# EAGLE design red_glow (EAGLE 7.4.0)
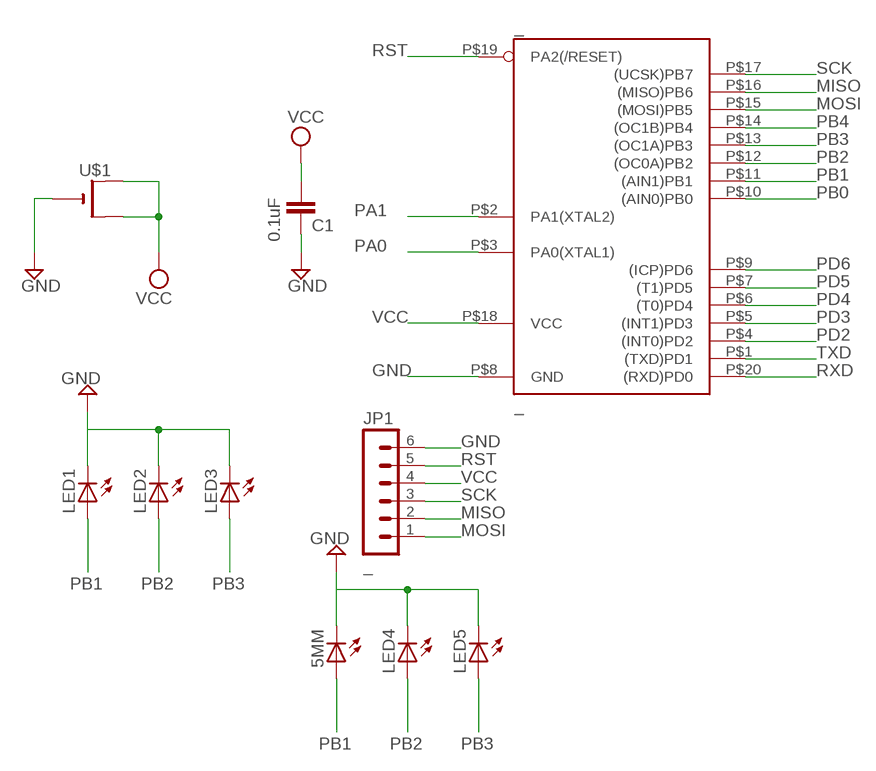
[diagram p0: schematic, sheet 1]

## Parts
5MM  LED5MM  [LED5MM]
_  _  TINY2313-*M*  [MLF20]
C1  0.1uF  CAP0805  [0805]
JP1  _  MA06-1  [MA06-1]
LED1  LED1206  [LED-1206]
LED2  LED1206  [LED-1206]
LED3  LED1206  [LED-1206]
LED4  LED5MM  [LED5MM]
LED5  LED5MM  [LED5MM]
U$1  CR2032SMT  [CR2032-SMD]

## Nets
GND [power]: 5MM.K(C) _.P$8(GND) C1.2 JP1.6 LED1.C LED2.C LED3.C LED4.K(C) LED5.K(C) U$1.-
MISO: _.P$16((MISO)PB6) JP1.2
MOSI: _.P$15((MOSI)PB5) JP1.1
PA0: _.P$3(PA0(XTAL1))
PA1: _.P$2(PA1(XTAL2))
PB0: _.P$10((AIN0)PB0)
PB1: 5MM.A _.P$11((AIN1)PB1) LED1.A
PB2: _.P$12((OC0A)PB2) LED2.A LED4.A
PB3: _.P$13((OC1A)PB3) LED3.A LED5.A
PB4: _.P$14((OC1B)PB4)
PD2: _.P$4((INT0)PD2)
PD3: _.P$5((INT1)PD3)
PD4: _.P$6((T0)PD4)
PD5: _.P$7((T1)PD5)
PD6: _.P$9((ICP)PD6)
RST: _.P$19(PA2(/RESET)) JP1.5
RXD: _.P$20((RXD)PD0)
SCK: _.P$17((UCSK)PB7) JP1.3
TXD: _.P$1((TXD)PD1)
VCC [power]: _.P$18(VCC) C1.1 JP1.4 U$1.+$1(+) U$1.+$2(+1)

## Library data of the parts
5MM LED4 LED5 = adafruit:LED: LED OSRAM: - CHIPLED LG R971, LG N971, LY N971, LG Q971, LY Q971, LO R971, LY R971 LH N974, LH R974 LS Q976, LO Q976, LY Q976 LO Q996 - Hyper CHIPLED LW Q18S LB Q993, LB Q99A, LB R99A - SideLED LS A670, LO A670, LY A670, LG A670, LP A670 LB A673, LV A673, LT A673, LW A673 LH A674 LY A675 LS A676, LA A676, LO A676, LY A676, LW A676 LS A679, LY A679, LG A679 - Hyper Micro SIDELED® LS Y876, LA Y876, LO Y876, LY Y876 LT Y87S - SmartLED LW L88C, LW L88S LB L89C, LB L89S, LG L890 LS L89K, LO L89K, LY L89K LS L896, LA L896, LO L896, LY L896 - TOPLED LS T670, LO T670, LY T670, LG T670, LP T670 LSG T670, LSP T670, LSY T670, LOP T670, LYG T670 LG T671, LOG T671, LSG T671 LB T673, LV T673, LT T673, LW T673 LH T674 LS T676, LA T676, LO T676, LY T676, LB T676, LH T676, LSB T676, LW T676 LB T67C, LV T67C, LT T67C, LS T67K, LO T67K, LY T67K, LW E67C LS E67B, LA E67B, LO E67B, LY E67B, LB E67C, LV E67C, LT E67C LW T67C LS T679, LY T679, LG T679 LS T770, LO T770, LY T770, LG T770, LP T770 LB T773, LV T773, LT T773, LW T773 LH T774 LS E675, LA E675, LY E675, LS T675 LS T776, LA T776, LO T776, LY T776, LB T776 LHGB T686 LT T68C, LB T68C - Hyper Mini TOPLED® LB M676 - Mini TOPLED Santana® LG M470 LS M47K, LO M47K, LY M47K Source: http://www.osram.convergy.de/
_ = NSL_Cylon:TINY2313*: Atmel Tiny2313 2K Flash, 128 bytes EEPROM, 128 bytes RAM
C1 = SparkFun:CAP: Capacitor Standard 0603 ceramic capacitor, and 0.1" leaded capacitor.
JP1 = con-lstb:MA06-1: PIN HEADER
LED1-LED3 = SparkFun-LED:LED: LEDs Standard schematic elements and footprints for 5mm, 3mm, 1206, and 0603 sized LEDs. 5mm - Spark Fun Electronics SKU : COM-00529 (and others)
U$1 = adafruit:CR2032

## Net classes
1 power: width 0.254 mm
2 leds: width 0.508 mm

## Board
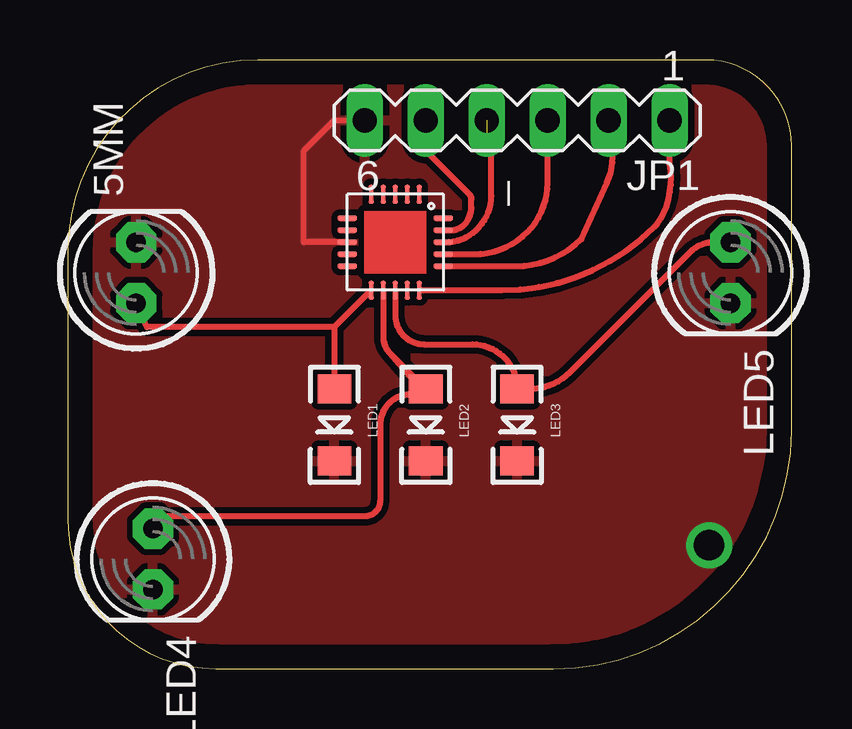
[diagram p1: board, top side]
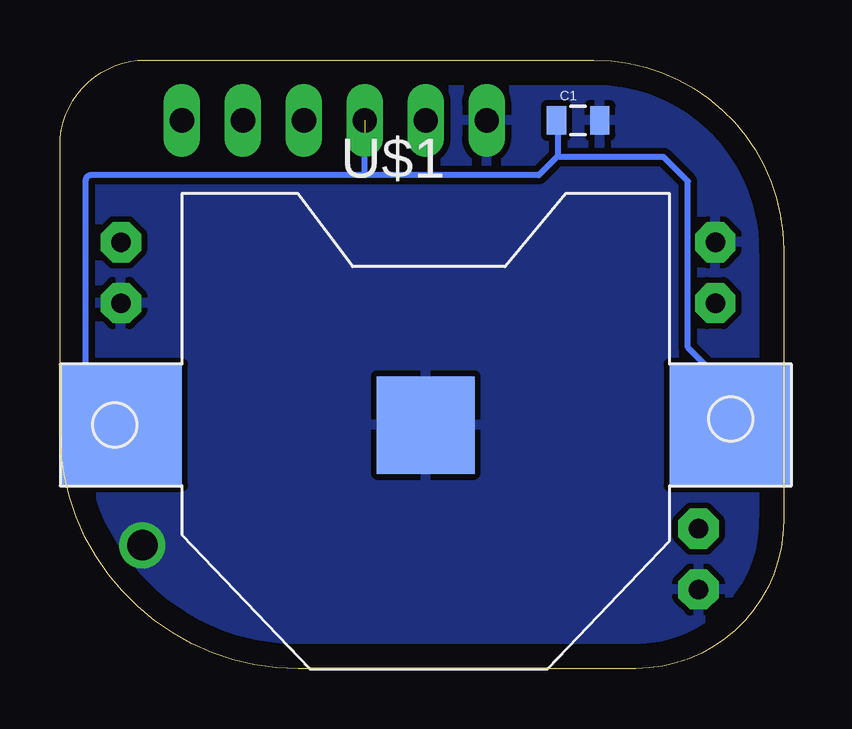
[diagram p2: board, bottom side, seen from below]

Size 30.15 x 25.38 mm. Coordinates in mm from the lower left corner, seen from the top.
Outline: 26.57,25.38 7.91,25.38 arc90 0,17.47 0,6.16 arc90 6.16,0 20.23,0 arc90 30.15,9.92 30.15,21.8 arc90 26.57,25.38
Copper layers (1*16): Top 0.035mm / dielectric 1.5mm / Bottom 0.035mm
Design rules "default": minimum track width 10mil, minimum drill 24mil, track to track 8mil, track to pad 8mil, pad to pad 8mil, via to via 8mil, smd to smd 8mil, copper to edge 40mil, drill to drill 8mil, minimum pad ring 10mil, minimum via ring 8mil, stop-mask expansion 4mil, vias tented up to drill 0mil, thermal gap 10mil

### Footprints (pad centres in the part's own frame; a part is rotated, then mirrored left to right if it is on the bottom)
LED5MM = drill 0.813 pad 1.676 octagon: A -1.27,0; K 1.27,0
MLF20 = smd 0.8 x 0.23: P$1 -2,1; P$2 -2,0.5; P$3 -2,0; P$4 -2,-0.5; P$5 -2,-1; P$11 2,-1; P$12 2,-0.5; P$13 2,0; P$14 2,0.5; P$15 2,1 | smd 0.23 x 0.8: P$6 -1,-2; P$7 -0.5,-2; P$8 0,-2; P$9 0.5,-2; P$10 1,-2; P$16 1,2; P$17 0.5,2; P$18 0,2; P$19 -0.5,2; P$20 -1,2
0805 = smd 0.8 x 1.2: 1 -0.9,0; 2 0.9,0
MA06-1 = drill 1.016 long: 1 -6.35,0; 2 -3.81,0; 3 -1.27,0; 4 1.27,0; 5 3.81,0; 6 6.35,0
LED-1206 = smd 1.2 x 1.4: A -1.5,0; C 1.5,0
CR2032-SMD = smd 5.08 x 5.08: +$1 -12.7,0; +$2 12.7,0 | smd 4.064 x 4.064: - 0,0

### Placement (x,y rotation side)
5MM  2.85,16.51 90 top
_  13.64,17.78 270 top
C1  8.56,22.86 0 bottom
JP1  18.72,22.86 180 top
LED1  11.1,10.16 270 top
LED2  14.91,10.16 270 top
LED3  18.72,10.16 270 top
LED4  3.54,4.57 270 top
LED5  27.61,16.51 270 top
U$1  14.91,10.16 0 bottom

### Tracks (layer width: path | path; a pad name or v marks a point on that pad's centre or on a via)
GND  (via drill 1.27)
  Top 0.254: _.P$8 9.83,17.78 9.83,21.59 11.1,22.86 JP1.6
  other vias: 26.72,5.14
  pour Bottom (isolate 0.254): -0.33,26.67 -0.33,0 31.42,0 31.42,26.67
  pour Top (isolate 0.254): -0.33,26.67 -0.33,0 31.42,0 31.42,26.67
  pour Bottom (isolate 0.254): -1.6,27.94 -1.6,1.27 30.15,1.27 30.15,27.94
MISO
  Top 0.254: _.P$16 18.66,16.78 arc45 21.39,17.91 22.46,20.25 arc45 22.53,22.22 JP1.2
MOSI
  Top 0.254: _.P$15 18.07,15.78 arc45 24.44,18.42 24.54,18.52 arc45 25.07,21.06 JP1.1
PB1
  Top 0.254: _.P$11 11.1,14.24 | 11.1,14.24 LED1.A | 11.1,14.24 3.29,14.24 5MM.A
PB2
  Top 0.254: _.P$12 13.14,13.8 arc45 13.4,13.17 | 13.4,13.17 LED2.A | 4.24,5.46 LED4.A arc-90 4.05,6.35 12.37,6.35 arc90 13,6.98 13,10.16 arc-90 14.27,11.43 14.91,11.43 13.4,13.17
PB3
  Top 0.254: LED5.A 26.93,17.78 arc45 25.92,17.36 20.9,12.34 arc-45 19.26,11.66 LED3.A arc90 16.86,13.52 14.85,13.52 arc-90 13.64,14.73 _.P$13
RST
  Top 0.254: _.P$19 15.94,18.28 arc67 16.7,18.79 16.75,18.89 arc23 16.82,19.23 16.82,19.58 arc45 16.74,19.76 14.91,21.59 JP1.5
SCK
  Top 0.254: _.P$17 16.92,17.28 arc45 19.14,18.2 arc45 19.99,20.25 JP1.3
VCC  (1 unrouted)
  Top 0.254: _.P$18 15.7,17.78 arc90 17.64,19.72 17.64,22.16 17.45,22.35
  Bottom 0.254: 9.39,21.4 10.21,20.57 17.45,20.57 | 9.39,21.4 9.39,22.79 C1.1 | U$1.+$2 2.21,11.62 3.99,13.4 3.99,20.32 5,21.34 9.32,21.34 9.39,21.4 | U$1.+$1 29.07,11.62 29.07,20.38 arc90 28.88,20.57 17.45,20.57 | 17.45,20.57 JP1.4